# Altium schematic sheet Sheet1.SchDoc
size A4
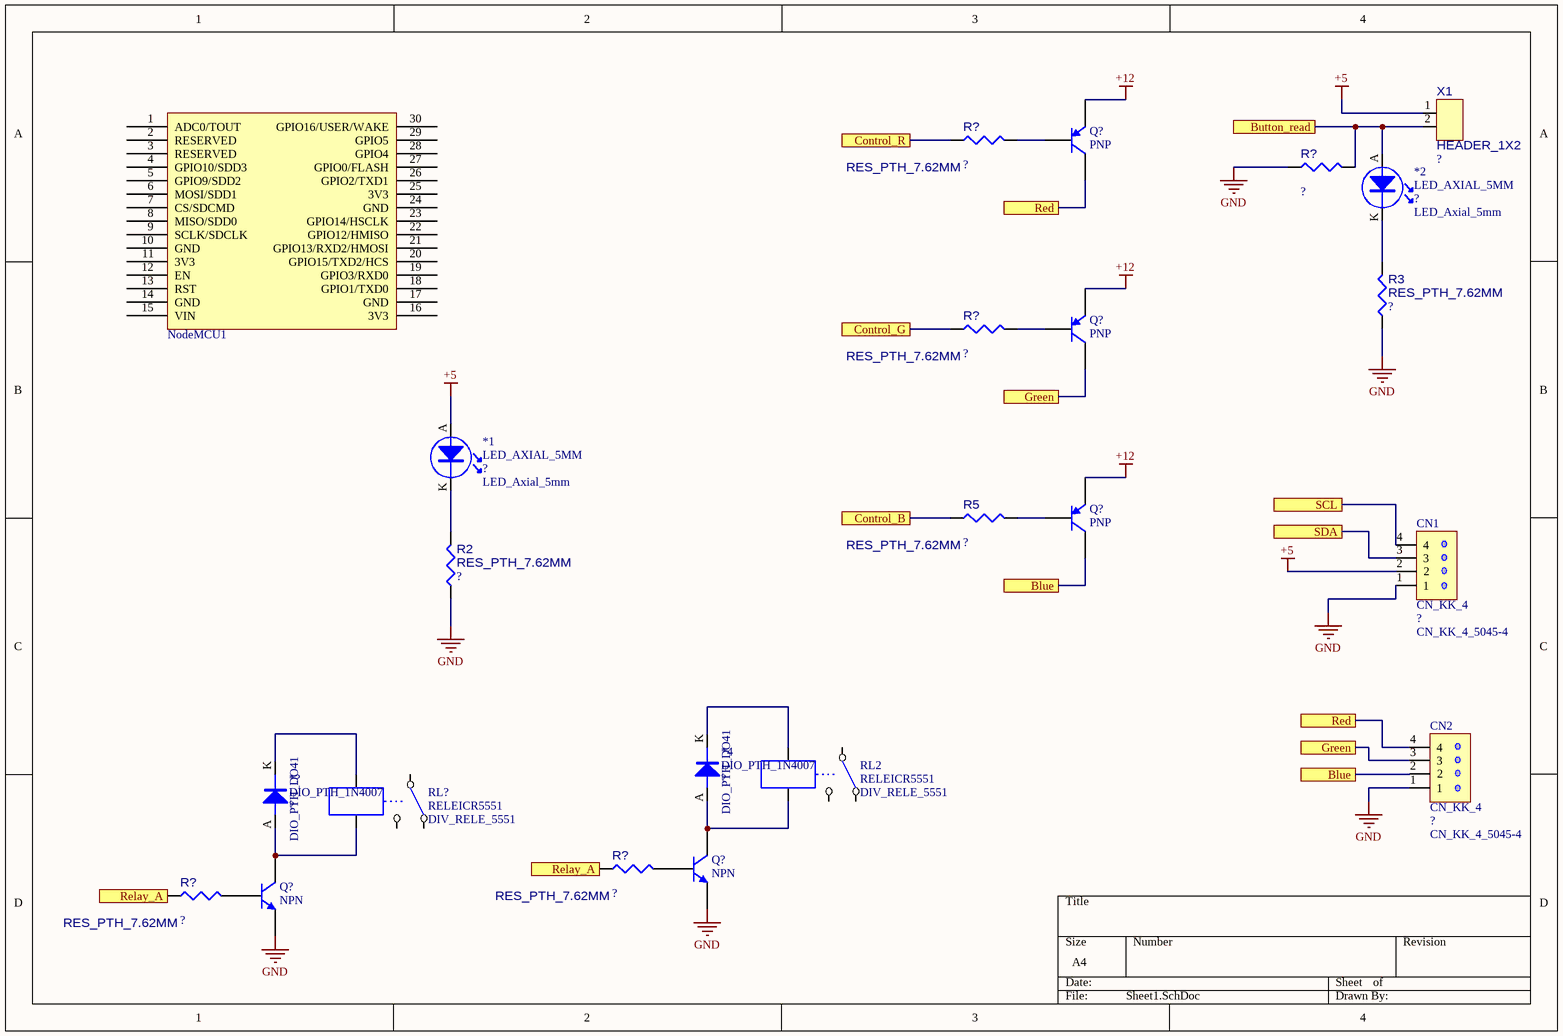
[diagram p0: Sheet1.SchDoc]

## Parts
(Parts that share a designator on the sheet are numbered #1, #2 ... from top to bottom, then left to right.)
*1  LED_AXIAL_5MM  [LED_Axial_5mm]
*2  LED_AXIAL_5MM  [LED_Axial_5mm]
*4  DIO_PTH_1N4007  [DIO_PTH_DO41]
*?  DIO_PTH_1N4007  [DIO_PTH_DO41]
CN1  CN_KK_4  [CN_KK_4_5045-4]
CN2  CN_KK_4  [CN_KK_4_5045-4]
NodeMCU1  ESP8266 Development kit  [DIV_NodeMCU_Socket]  (value not drawn)
Q?#1  PNP  [SOT-23B_L]
Q?#2  PNP  [SOT-23B_L]
Q?#3  PNP  [SOT-23B_L]
Q?#4  NPN  [TO-226-AA]
Q?#5  NPN  [TO-226-AA]
R2  ?  [RES_PTH_7.62MM]
R3  ?  [RES_PTH_7.62MM]
R5  ?  [RES_PTH_7.62MM]
R?#1  ?  [RES_PTH_7.62MM]
R?#2  ?  [RES_PTH_7.62MM]
R?#3  ?  [RES_PTH_7.62MM]
R?#4  ?  [RES_PTH_7.62MM]
R?#5  ?  [RES_PTH_7.62MM]
RL2  RELEICR5551  [DIV_RELE_5551]
RL?  RELEICR5551  [DIV_RELE_5551]
X1  ?  [HEADER_1X2]

## Ports
Blue, Button_read, Control_B, Control_G, Control_R, Green, Red, Relay_A, SCL, SDA

## Nets
+5: *1.A CN1.2 X1.1
+12: Q?#1.3(E) Q?#2.3(E) Q?#3.3(E)
GND: CN1.1 CN2.1 Q?#4.3(E) Q?#5.3(E) R2.1 R3.1 R?#2.1
Blue: CN2.2 Q?#3.1(C) ; port Blue
Button_read: *2.A R?#2.2 X1.2 ; port Button_read
Control_B: R5.1 ; port Control_B
Control_G: R?#3.1 ; port Control_G
Control_R: R?#1.1 ; port Control_R
Green: CN2.3 Q?#2.1(C) ; port Green
Red: CN2.4 Q?#1.1(C) ; port Red
Relay_A: R?#4.1 R?#5.1 ; port Relay_A
SCL: CN1.4 ; port SCL
SDA: CN1.3 ; port SDA
Net*1_K: *1.K R2.2
Net*2_K: *2.K R3.2
Net*4_A: *4.A Q?#4.1(C) RL2.5
Net*4_K: *4.K RL2.4
Net*?_A: *?.A Q?#5.1(C) RL?.5
Net*?_K: *?.K RL?.4
NetQ?#1_2: Q?#1.2(B) R?#1.2
NetQ?#2_2: Q?#2.2(B) R?#3.2
NetQ?#3_2: Q?#3.2(B) R5.2
NetQ?#4_2: Q?#4.2(B) R?#4.2
NetQ?#5_2: Q?#5.2(B) R?#5.2

Not connected (* = marked no-connect by the designer): NodeMCU1 1(ADC0/TOUT) 2(RESERVED) 3(RESERVED) 4(GPIO10/SDD3) 5(GPIO9/SDD2) 6(MOSI/SDD1) 7(CS/SDCMD) 8(MISO/SDD0) 9(SCLK/SDCLK) 10(GND) 11(3V3) 12(EN) 13(RST) 14(GND) 15(VIN) 16(3V3) 17(GND) 18(GPIO1/TXD0) 19(GPIO3/RXD0) 20(GPIO15/TXD2/HCS) 21(GPIO13/RXD2/HMOSI) 22(GPIO12/HMISO) 23(GPIO14/HSCLK) 24(GND) 25(3V3) 26(GPIO2/TXD1) 27(GPIO0/FLASH) 28(GPIO4) 29(GPIO5) 30(GPIO16/USER/WAKE); RL2 1 2 3; RL? 1 2 3

## Library data of the parts
CN1 CN2 = CN_KK_4: KK_4; Value: ?
NodeMCU1 = NodeMCU: Reference: https://bennthomsen.files.wordpress.com/2015/12/nodemcu_pinout_700-2.png; Schematic: https://raw.githubusercontent.com/nodemcu/nodemcu-devkit/master/Documents/NODEMCU_DEVKIT_SCH.png
Q?#1-Q?#3 = PNP: PNP Bipolar Transistor; Published: 8-Jun-2000; LatestRevisionDate: 29-May-2009; LatestRevisionNote: IPC-7351 Footprint Added.; PackageVersion: Aug-1999; PackageReference: SOT-23B; Publisher: Altium Limited; PackageDescription: 3-Pin SOT-23 Package 0.95 mm Pitch, 2.4 mm Lead Span
Q?#4 Q?#5 = NPN: NPN Bipolar Transistor; Published: 8-Jun-2000; LatestRevisionDate: 17-Jul-2002; LatestRevisionNote: Re-released for DXP Platform.; PackageReference: TO-226-AA; Publisher: Altium Limited; PackageDescription: TO, Flat Index; 3 In-Line, Axial Leads; Body Dia. 4.8mm; Leads 0.55 x 0.51 mm (max); Code_JEDEC: TO-226-AA
R2 R3 R5 R?#1-R?#5 = RES_PTH_7.62MM: Pin Through Hole Resistor 7.62mm; Value: ?
X1 = HEADER_1X2: 1X2; Value: ?
*1 *2 = LED_AXIAL_5MM: Value: ?
*4 *? = DIO_PTH_1N4007: Value: ?
RL2 RL? = RELEICR5551: Value: RELEICR5551